# EAGLE schematic zx81 SD_12 (smd) (EAGLE 9.6.2)

## Sheet 1 of 2
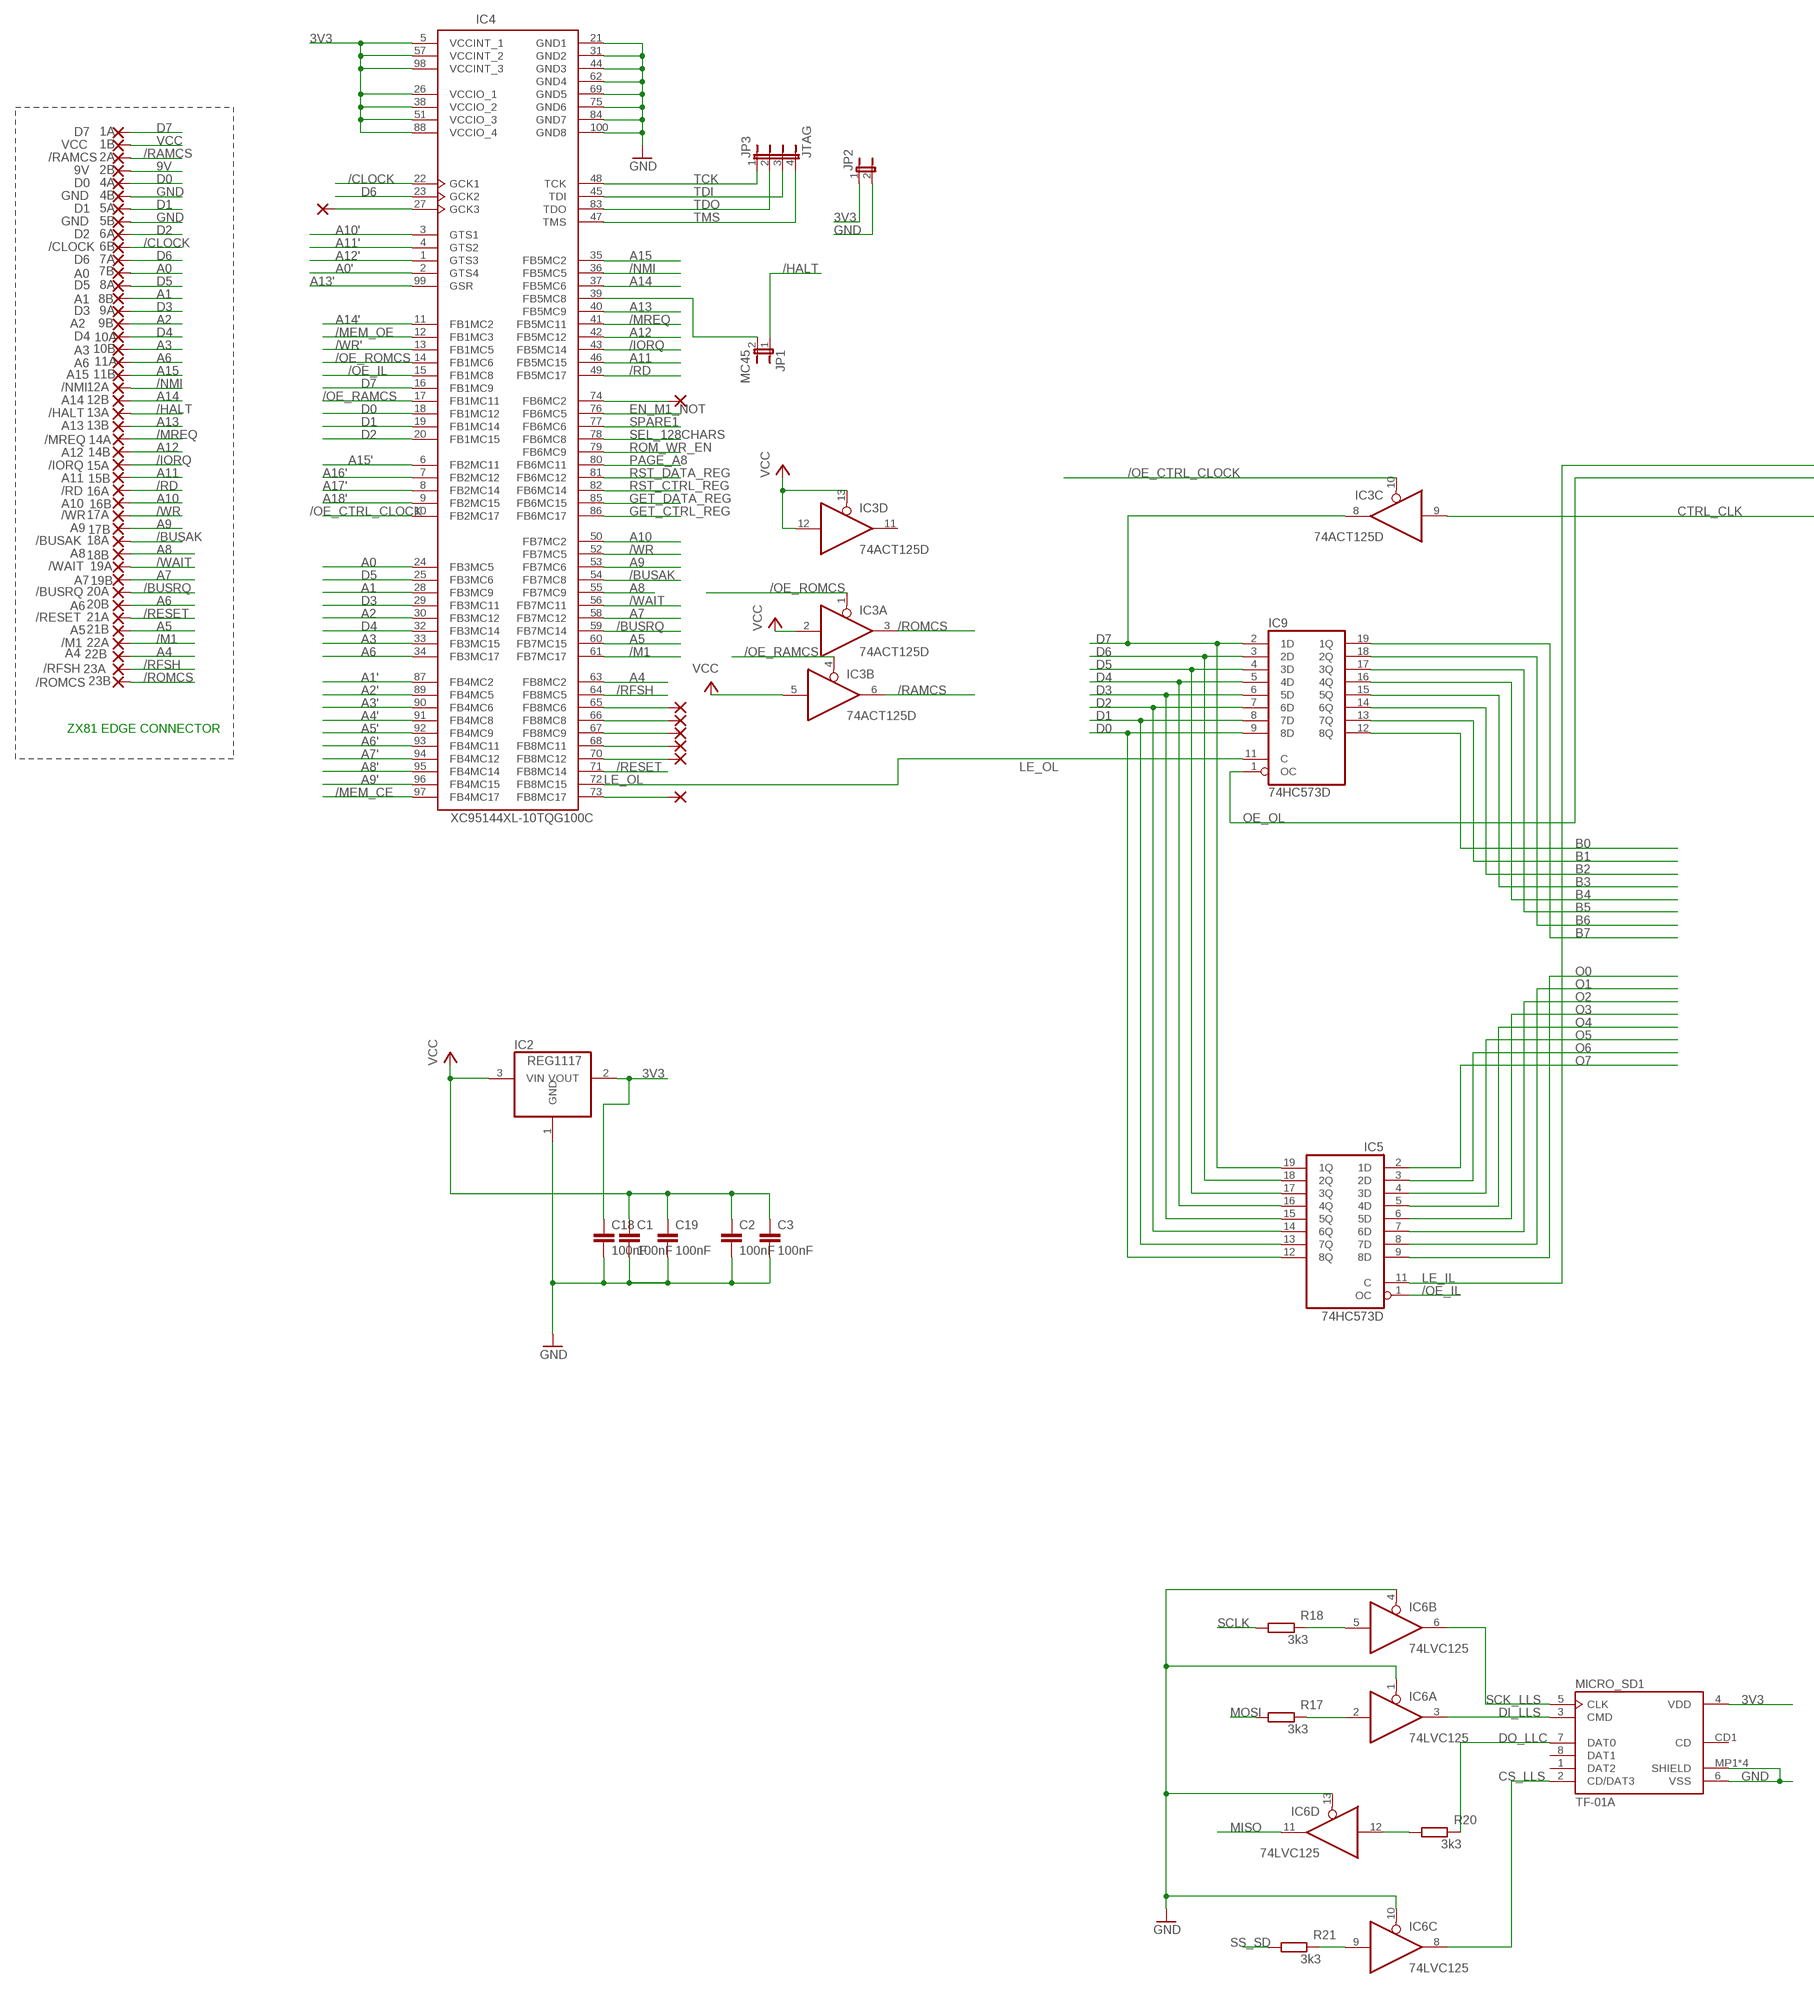
[diagram p0: schematic, sheet 1, part 1 of 2]
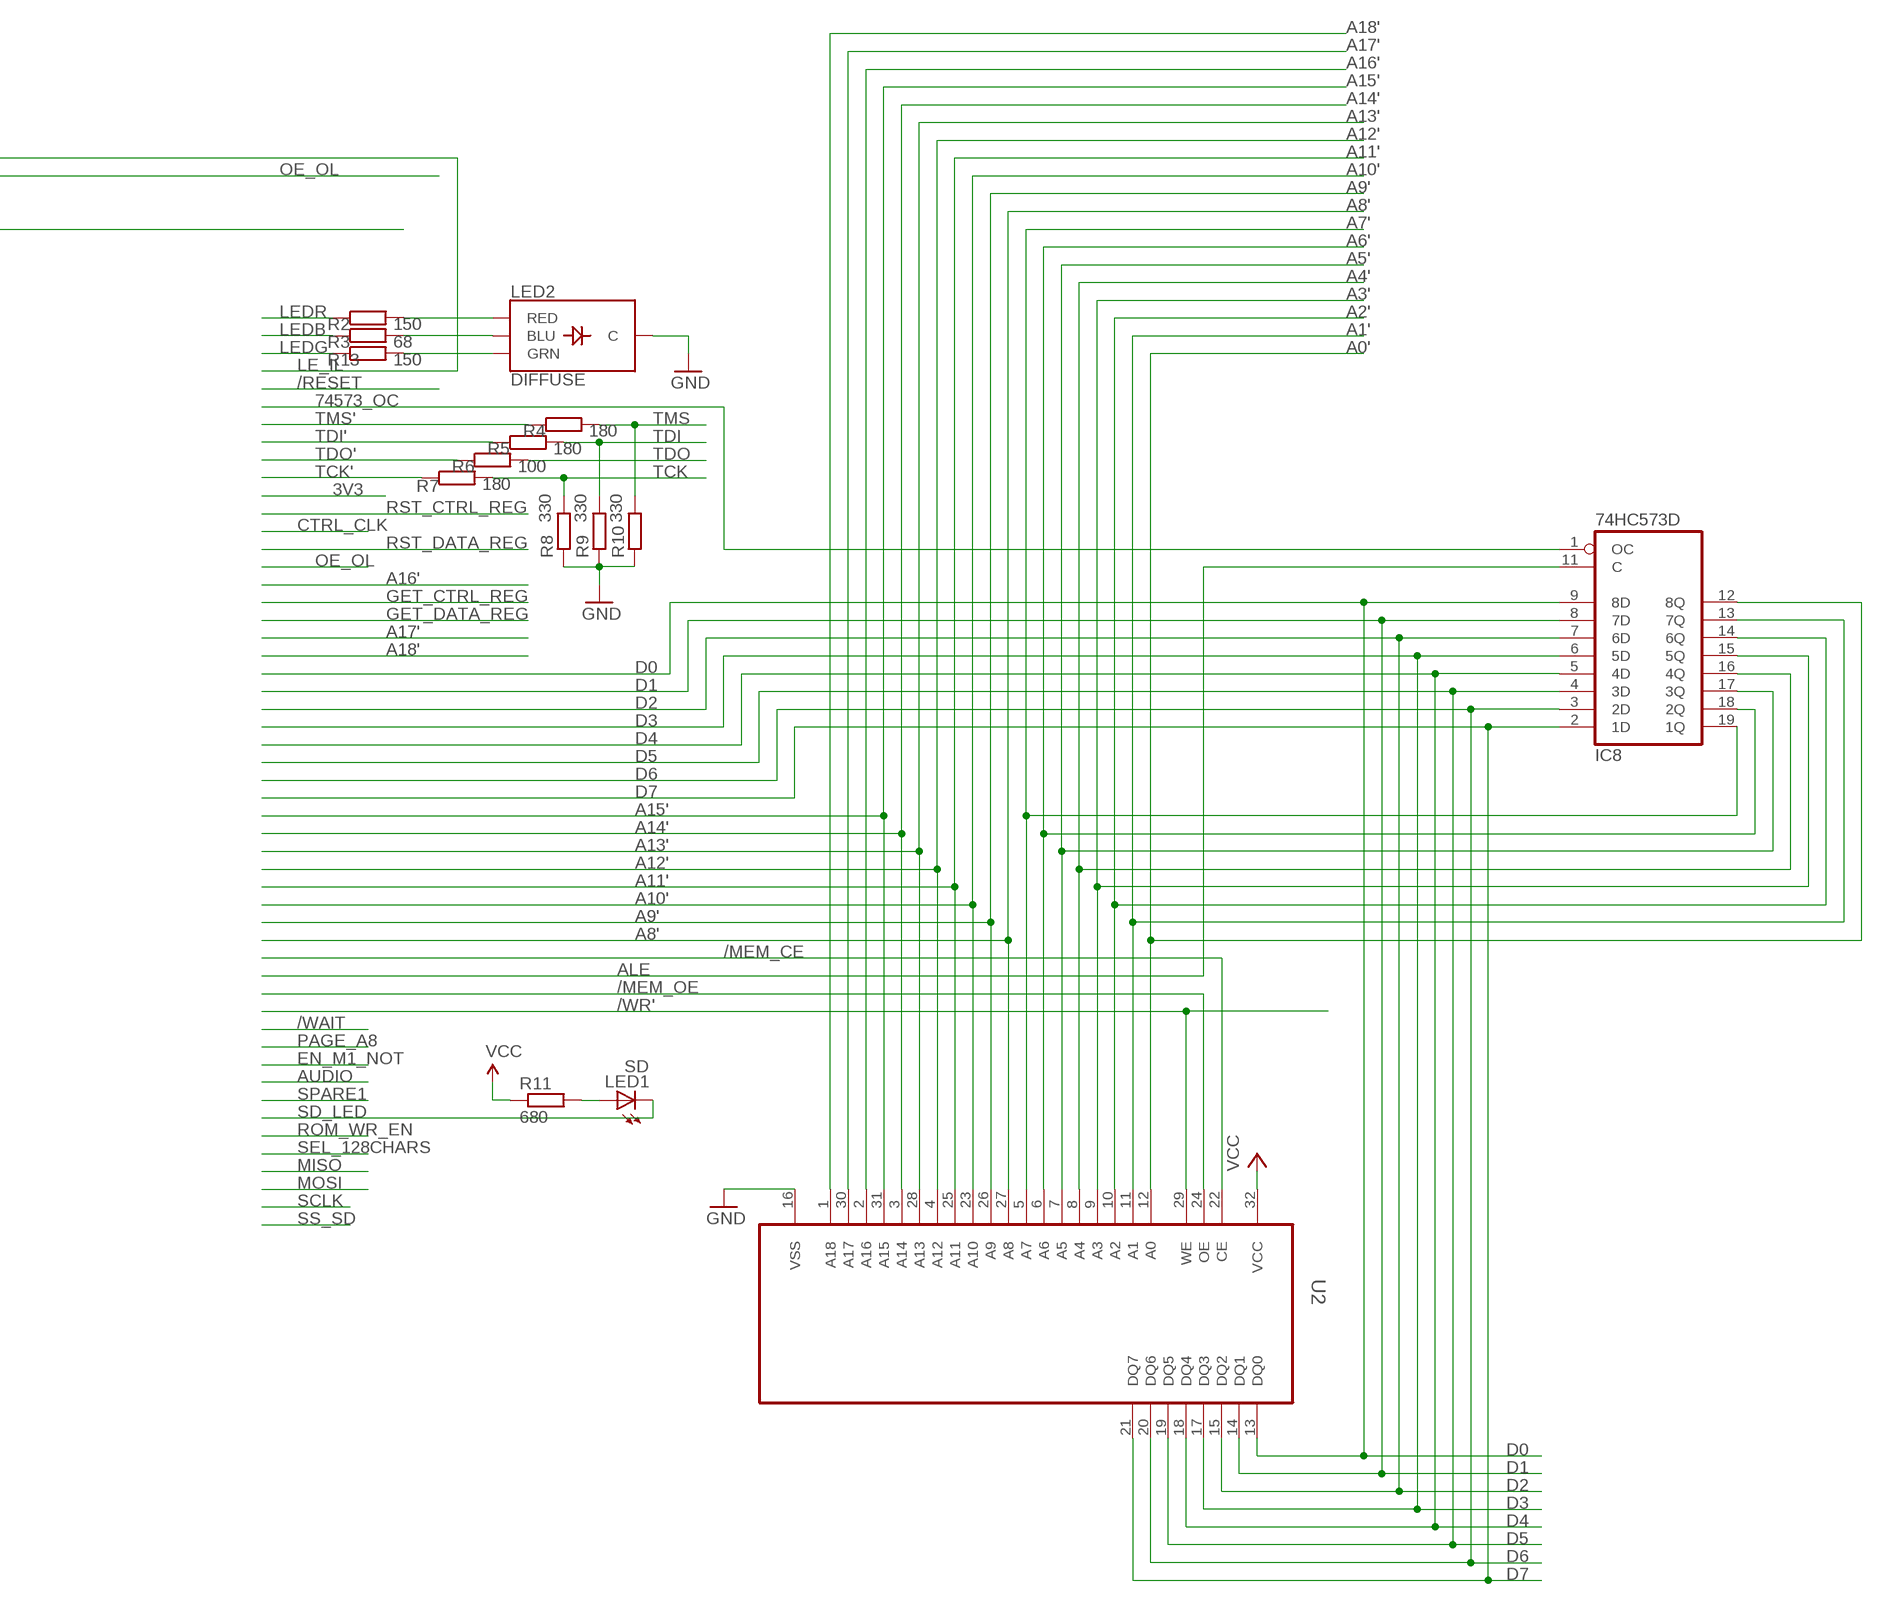
[diagram p1: schematic, sheet 1, part 2 of 2]

### Parts
1A  D7  SMD2EDGEPIN  [EDGEPIN]
1B  VCC  SMD2EDGEPIN  [EDGEPIN]
2A  /RAMCS  SMD2EDGEPIN  [EDGEPIN]
2B  9V  SMD2EDGEPIN  [EDGEPIN]
4A  D0  SMD2EDGEPIN  [EDGEPIN]
4B  GND  SMD2EDGEPIN  [EDGEPIN]
5A  D1  SMD2EDGEPIN  [EDGEPIN]
5B  GND  SMD2EDGEPIN  [EDGEPIN]
6A  D2  SMD2EDGEPIN  [EDGEPIN]
6B  /CLOCK  SMD2EDGEPIN  [EDGEPIN]
7A  D6  SMD2EDGEPIN  [EDGEPIN]
7B  A0  SMD2EDGEPIN  [EDGEPIN]
8A  D5  SMD2EDGEPIN  [EDGEPIN]
8B  A1  SMD2EDGEPIN  [EDGEPIN]
9A  D3  SMD2EDGEPIN  [EDGEPIN]
9B  A2  SMD2EDGEPIN  [EDGEPIN]
10A  D4  SMD2EDGEPIN  [EDGEPIN]
10B  A3  SMD2EDGEPIN  [EDGEPIN]
11A  A6  SMD2EDGEPIN  [EDGEPIN]
11B  A15  SMD2EDGEPIN  [EDGEPIN]
12A  /NMI  SMD2EDGEPIN  [EDGEPIN]
12B  A14  SMD2EDGEPIN  [EDGEPIN]
13A  /HALT  SMD2EDGEPIN  [EDGEPIN]
13B  A13  SMD2EDGEPIN  [EDGEPIN]
14A  /MREQ  SMD2EDGEPIN  [EDGEPIN]
14B  A12  SMD2EDGEPIN  [EDGEPIN]
15A  /IORQ  SMD2EDGEPIN  [EDGEPIN]
15B  A11  SMD2EDGEPIN  [EDGEPIN]
16A  /RD  SMD2EDGEPIN  [EDGEPIN]
16B  A10  SMD2EDGEPIN  [EDGEPIN]
17A  /WR  SMD2EDGEPIN  [EDGEPIN]
17B  A9  SMD2EDGEPIN  [EDGEPIN]
18A  /BUSAK  SMD2EDGEPIN  [EDGEPIN]
18B  A8  SMD2EDGEPIN  [EDGEPIN]
19A  /WAIT  SMD2EDGEPIN  [EDGEPIN]
19B  A7  SMD2EDGEPIN  [EDGEPIN]
20A  /BUSRQ  SMD2EDGEPIN  [EDGEPIN]
20B  A6  SMD2EDGEPIN  [EDGEPIN]
21A  /RESET  SMD2EDGEPIN  [EDGEPIN]
21B  A5  SMD2EDGEPIN  [EDGEPIN]
22A  /M1  SMD2EDGEPIN  [EDGEPIN]
22B  A4  SMD2EDGEPIN  [EDGEPIN]
23A  /RFSH  SMD2EDGEPIN  [EDGEPIN]
23B  /ROMCS  SMD2EDGEPIN  [EDGEPIN]
C1  100nF  C-EUC0603  [C0603]
C2  100nF  C-EUC0603  [C0603]
C3  100nF  C-EUC0603  [C0603]
C18  100nF  C-EUC0603  [C0603]
C19  100nF  C-EUC0603  [C0603]
IC2  REG1117  [SOT223]
IC3  74ACT125D  [SO14]
IC4  XC95144XL-10TQG100C  [TQFP100]
IC5  74HC573D  [SO20W]
IC6  74LVC125  74LS125D  [SO14]
IC8  74HC573D  [SO20W]
IC9  74HC573D  [SO20W]
JP1  MC45  JP1E  [JP1]
JP2  JP1E  [JP1]
JP3  JTAG  JP4E  [JP4]
LED1  SD  LED5MM  [LED5MM]
LED2  DIFFUSE  LED-RGB-CCDIFFUSE  [LED-RGB-THRU]
MICRO_SD1  TF-01A  [TF-01A]
PAD1  1,6/0,8  [1,6/0,8]
PAD2  1,6/0,8  [1,6/0,8]
PAD3  1,6/0,8  [1,6/0,8]
PAD4  1,6/0,8  [1,6/0,8]
PAD5  1,6/0,8  [1,6/0,8]
PAD6  1,6/0,8  [1,6/0,8]
PAD7  1,6/0,8  [1,6/0,8]
PAD8  1,6/0,8  [1,6/0,8]
R2  150  R-EU_R0603  [R0603]
R3  68  R-EU_R0603  [R0603]
R4  180  R-EU_R0603  [R0603]
R5  180  R-EU_R0603  [R0603]
R6  100  R-EU_R0603  [R0603]
R7  180  R-EU_R0603  [R0603]
R8  330  R-EU_R0603  [R0603]
R9  330  R-EU_R0603  [R0603]
R10  330  R-EU_R0603  [R0603]
R11  680  R-EU_R0603  [R0603]
R13  150  R-EU_R0603  [R0603]
R17  3k3  R-EU_R0603  [R0603]
R18  3k3  R-EU_R0603  [R0603]
R20  3k3  R-EU_R0603  [R0603]
R21  3k3  R-EU_R0603  [R0603]
U2  AS6C4008-55SINSOP5  [SOP32-5]

### Nets
3V3: C18.1 IC2.2(VOUT) IC4.5(VCCINT_1) IC4.26(VCCIO_1) IC4.38(VCCIO_2) IC4.51(VCCIO_3) IC4.57(VCCINT_2) IC4.88(VCCIO_4) IC4.98(VCCINT_3) JP2.1 MICRO_SD1.4(VDD) ; also sheet 2
9V [VCC]: 2B.1(P)
74573_OC: IC8.1(OC) ; also sheet 2
/BUSAK: 18A.1(P) IC4.54(FB7MC8)
/BUSRQ: 20A.1(P) IC4.59(FB7MC14)
/CLOCK: 6B.1(P) IC4.22(GCK1)
/HALT: 13A.1(P) JP1.1
/IORQ: 15A.1(P) IC4.43(FB5MC14)
/M1: 22A.1(P) IC4.61(FB7MC17)
/MEM_CE: IC4.97(FB4MC17) U2.22(CE) ; also sheet 2
/MEM_OE: IC4.12(FB1MC3) U2.24(OE) ; also sheet 2
/MREQ: 14A.1(P) IC4.41(FB5MC11)
/NMI: 12A.1(P) IC4.36(FB5MC5)
/OE_CTRL_CLOCK: IC3.10(C:OE) IC4.10(FB2MC17)
/OE_IL: IC4.15(FB1MC8) IC5.1(OC)
/OE_RAMCS: IC3.4(B:OE) IC4.17(FB1MC11)
/OE_ROMCS: IC3.1(A:OE) IC4.14(FB1MC6)
/RAMCS: 2A.1(P) IC3.6(B:O)
/RD: 16A.1(P) IC4.49(FB5MC17)
/RESET: 21A.1(P) IC4.71(FB8MC14) ; also sheet 2
/RFSH: 23A.1(P) IC4.64(FB8MC5)
/ROMCS: 23B.1(P) IC3.3(A:O)
/WAIT: 19A.1(P) IC4.56(FB7MC11) ; also sheet 2
/WR: 17A.1(P) IC4.52(FB7MC5)
/WR': IC4.13(FB1MC5) U2.29(WE) ; also sheet 2
A0: 7B.1(P) IC4.24(FB3MC5)
A0': IC4.2(GTS4) IC8.12(8Q) U2.12(A0)
A1: 8B.1(P) IC4.28(FB3MC9)
A1': IC4.87(FB4MC2) IC8.13(7Q) U2.11(A1)
A2: 9B.1(P) IC4.30(FB3MC12)
A2': IC4.89(FB4MC5) IC8.14(6Q) U2.10(A2)
A3: 10B.1(P) IC4.33(FB3MC15)
A3': IC4.90(FB4MC6) IC8.15(5Q) U2.9(A3)
A4: 22B.1(P) IC4.63(FB8MC2)
A4': IC4.91(FB4MC8) IC8.16(4Q) U2.8(A4)
A5: 21B.1(P) IC4.60(FB7MC15)
A5': IC4.92(FB4MC9) IC8.17(3Q) U2.7(A5)
A6: 11A.1(P) 20B.1(P) IC4.34(FB3MC17)
A6': IC4.93(FB4MC11) IC8.18(2Q) U2.6(A6)
A7: 19B.1(P) IC4.58(FB7MC12)
A7': IC4.94(FB4MC12) IC8.19(1Q) U2.5(A7)
A8: 18B.1(P) IC4.55(FB7MC9)
A8': IC4.95(FB4MC14) U2.27(A8) ; also sheet 2
A9: 17B.1(P) IC4.53(FB7MC6)
A9': IC4.96(FB4MC15) U2.26(A9) ; also sheet 2
A10: 16B.1(P) IC4.50(FB7MC2)
A10': IC4.3(GTS1) U2.23(A10) ; also sheet 2
A11: 15B.1(P) IC4.46(FB5MC15)
A11': IC4.4(GTS2) U2.25(A11) ; also sheet 2
A12: 14B.1(P) IC4.42(FB5MC12)
A12': IC4.1(GTS3) U2.4(A12) ; also sheet 2
A13: 13B.1(P) IC4.40(FB5MC9)
A13': IC4.99(GSR) U2.28(A13) ; also sheet 2
A14: 12B.1(P) IC4.37(FB5MC6)
A14': IC4.11(FB1MC2) U2.3(A14) ; also sheet 2
A15: 11B.1(P) IC4.35(FB5MC2)
A15': IC4.6(FB2MC11) U2.31(A15) ; also sheet 2
A16': IC4.7(FB2MC12) U2.2(A16) ; also sheet 2
A17': IC4.8(FB2MC14) U2.30(A17) ; also sheet 2
A18': IC4.9(FB2MC15) U2.1(A18) ; also sheet 2
ALE: IC8.11(C) ; also sheet 2
B0: IC9.19(1Q) ; also sheet 2
B1: IC9.18(2Q) ; also sheet 2
B2: IC9.17(3Q) ; also sheet 2
B3: IC9.16(4Q) ; also sheet 2
B4: IC9.15(5Q) ; also sheet 2
B5: IC9.14(6Q) ; also sheet 2
B6: IC9.13(7Q) ; also sheet 2
B7: IC9.12(8Q) ; also sheet 2
CS_LLS: IC6.8(C:O) MICRO_SD1.2(CD/DAT3)
CTRL_CLK: IC3.9(C:I) ; also sheet 2
D0: 4A.1(P) IC4.18(FB1MC12) IC5.12(8Q) IC8.9(8D) IC9.9(8D) U2.13(DQ0) ; also sheet 2
D1: 5A.1(P) IC4.19(FB1MC14) IC5.13(7Q) IC8.8(7D) IC9.8(7D) U2.14(DQ1) ; also sheet 2
D2: 6A.1(P) IC4.20(FB1MC15) IC5.14(6Q) IC8.7(6D) IC9.7(6D) U2.15(DQ2) ; also sheet 2
D3: 9A.1(P) IC4.29(FB3MC11) IC5.15(5Q) IC8.6(5D) IC9.6(5D) U2.17(DQ3) ; also sheet 2
D4: 10A.1(P) IC4.32(FB3MC14) IC5.16(4Q) IC8.5(4D) IC9.5(4D) U2.18(DQ4) ; also sheet 2
D5: 8A.1(P) IC4.25(FB3MC6) IC5.17(3Q) IC8.4(3D) IC9.4(3D) U2.19(DQ5) ; also sheet 2
D6: 7A.1(P) IC4.23(GCK2) IC5.18(2Q) IC8.3(2D) IC9.3(2D) U2.20(DQ6) ; also sheet 2
D7: 1A.1(P) IC3.8(C:O) IC4.16(FB1MC9) IC5.19(1Q) IC8.2(1D) IC9.2(1D) U2.21(DQ7) ; also sheet 2
DI_LLS: IC6.3(A:O) MICRO_SD1.3(CMD)
DO_LLC: IC6.12(D:I) R20.1
EN_M1_NOT: IC4.76(FB6MC5) ; also sheet 2
GET_CTRL_REG: IC4.86(FB6MC17) ; also sheet 2
GET_DATA_REG: IC4.85(FB6MC15) ; also sheet 2
GND [VCC]: 4B.1(P) 5B.1(P) C1.2 C2.2 C3.2 C18.2 C19.2 IC2.1(GND) IC4.21(GND1) IC4.31(GND2) IC4.44(GND3) IC4.62(GND4) IC4.69(GND5) IC4.75(GND6) IC4.84(GND7) IC4.100(GND8) IC6.1(A:OE) IC6.4(B:OE) IC6.10(C:OE) IC6.13(D:OE) JP2.2 LED2.2(C) MICRO_SD1.6(VSS) MICRO_SD1.MP1(SHIELD) MICRO_SD1.MP2(SHIELD) MICRO_SD1.MP3(SHIELD) MICRO_SD1.MP4(SHIELD) R8.1 R9.1 R10.1 U2.16(VSS) ; also sheet 2
LE_IL: IC5.11(C) ; also sheet 2
LE_OL: IC4.72(FB8MC15) IC9.11(C)
LEDB: R3.1 ; also sheet 2
LEDG: R13.1 ; also sheet 2
LEDR: R2.1 ; also sheet 2
MISO: IC6.11(D:O) ; also sheet 2
MOSI: R17.1 ; also sheet 2
N$1: IC6.2(A:I) R17.2
N$2: IC4.74(FB6MC2) PAD8.1(P)
N$9: IC6.5(B:I) R18.2
N$11: IC4.65(FB8MC6) PAD2.1(P)
N$13: MICRO_SD1.7(DAT0) R20.2
N$14: IC6.9(C:I) R21.2
N$15: LED1.A R11.2
N$16: IC4.66(FB8MC8) PAD3.1(P)
N$19: IC4.67(FB8MC9) PAD4.1(P)
N$22: IC4.68(FB8MC11) PAD5.1(P)
N$23: IC4.73(FB8MC17) PAD6.1(P)
N$24: IC4.27(GCK3) PAD1.1(P)
N$25: IC4.70(FB8MC12) PAD7.1(P)
N$26: LED2.1(RED) R2.2
N$27: LED2.4(BLU) R3.2
N$28: LED2.3(GRN) R13.2
N$33: IC4.39(FB5MC8) JP1.2
O0: IC5.2(1D) ; also sheet 2
O1: IC5.3(2D) ; also sheet 2
O2: IC5.4(3D) ; also sheet 2
O3: IC5.5(4D) ; also sheet 2
O4: IC5.6(5D) ; also sheet 2
O5: IC5.7(6D) ; also sheet 2
O6: IC5.8(7D) ; also sheet 2
O7: IC5.9(8D) ; also sheet 2
OE_OL: IC9.1(OC) ; also sheet 2
PAGE_A8: IC4.80(FB6MC11) ; also sheet 2
ROM_WR_EN: IC4.79(FB6MC9) ; also sheet 2
RST_CTRL_REG: IC4.82(FB6MC14) ; also sheet 2
RST_DATA_REG: IC4.81(FB6MC12) ; also sheet 2
SCK_LLS: IC6.6(B:O) MICRO_SD1.5(CLK)
SCLK: R18.1 ; also sheet 2
SD_LED: LED1.K(C) ; also sheet 2
SEL_128CHARS: IC4.78(FB6MC8) ; also sheet 2
SPARE1: IC4.77(FB6MC6) ; also sheet 2
SS_SD: R21.1 ; also sheet 2
TCK: IC4.48(TCK) JP3.1 R7.2 R8.2
TCK': R7.1 ; also sheet 2
TDI: IC4.45(TDI) JP3.3 R5.2 R9.2
TDI': R5.1 ; also sheet 2
TDO: IC4.83(TDO) JP3.2 R6.2
TDO': R6.1 ; also sheet 2
TMS: IC4.47(TMS) JP3.4 R4.2 R10.2
TMS': R4.1 ; also sheet 2
VCC [VCC]: 1B.1(P) C1.1 C2.1 C3.1 C19.1 IC2.3(VIN) IC3.2(A:I) IC3.5(B:I) IC3.12(D:I) IC3.13(D:OE) R11.1 U2.32(VCC) ; also sheet 2
Unconnected: IC3.11(D:O) MICRO_SD1.1(DAT2) MICRO_SD1.8(DAT1) MICRO_SD1.CD1(CD)

### Notes on the sheet
- ZX81 EDGE CONNECTOR

## Sheet 2 of 2
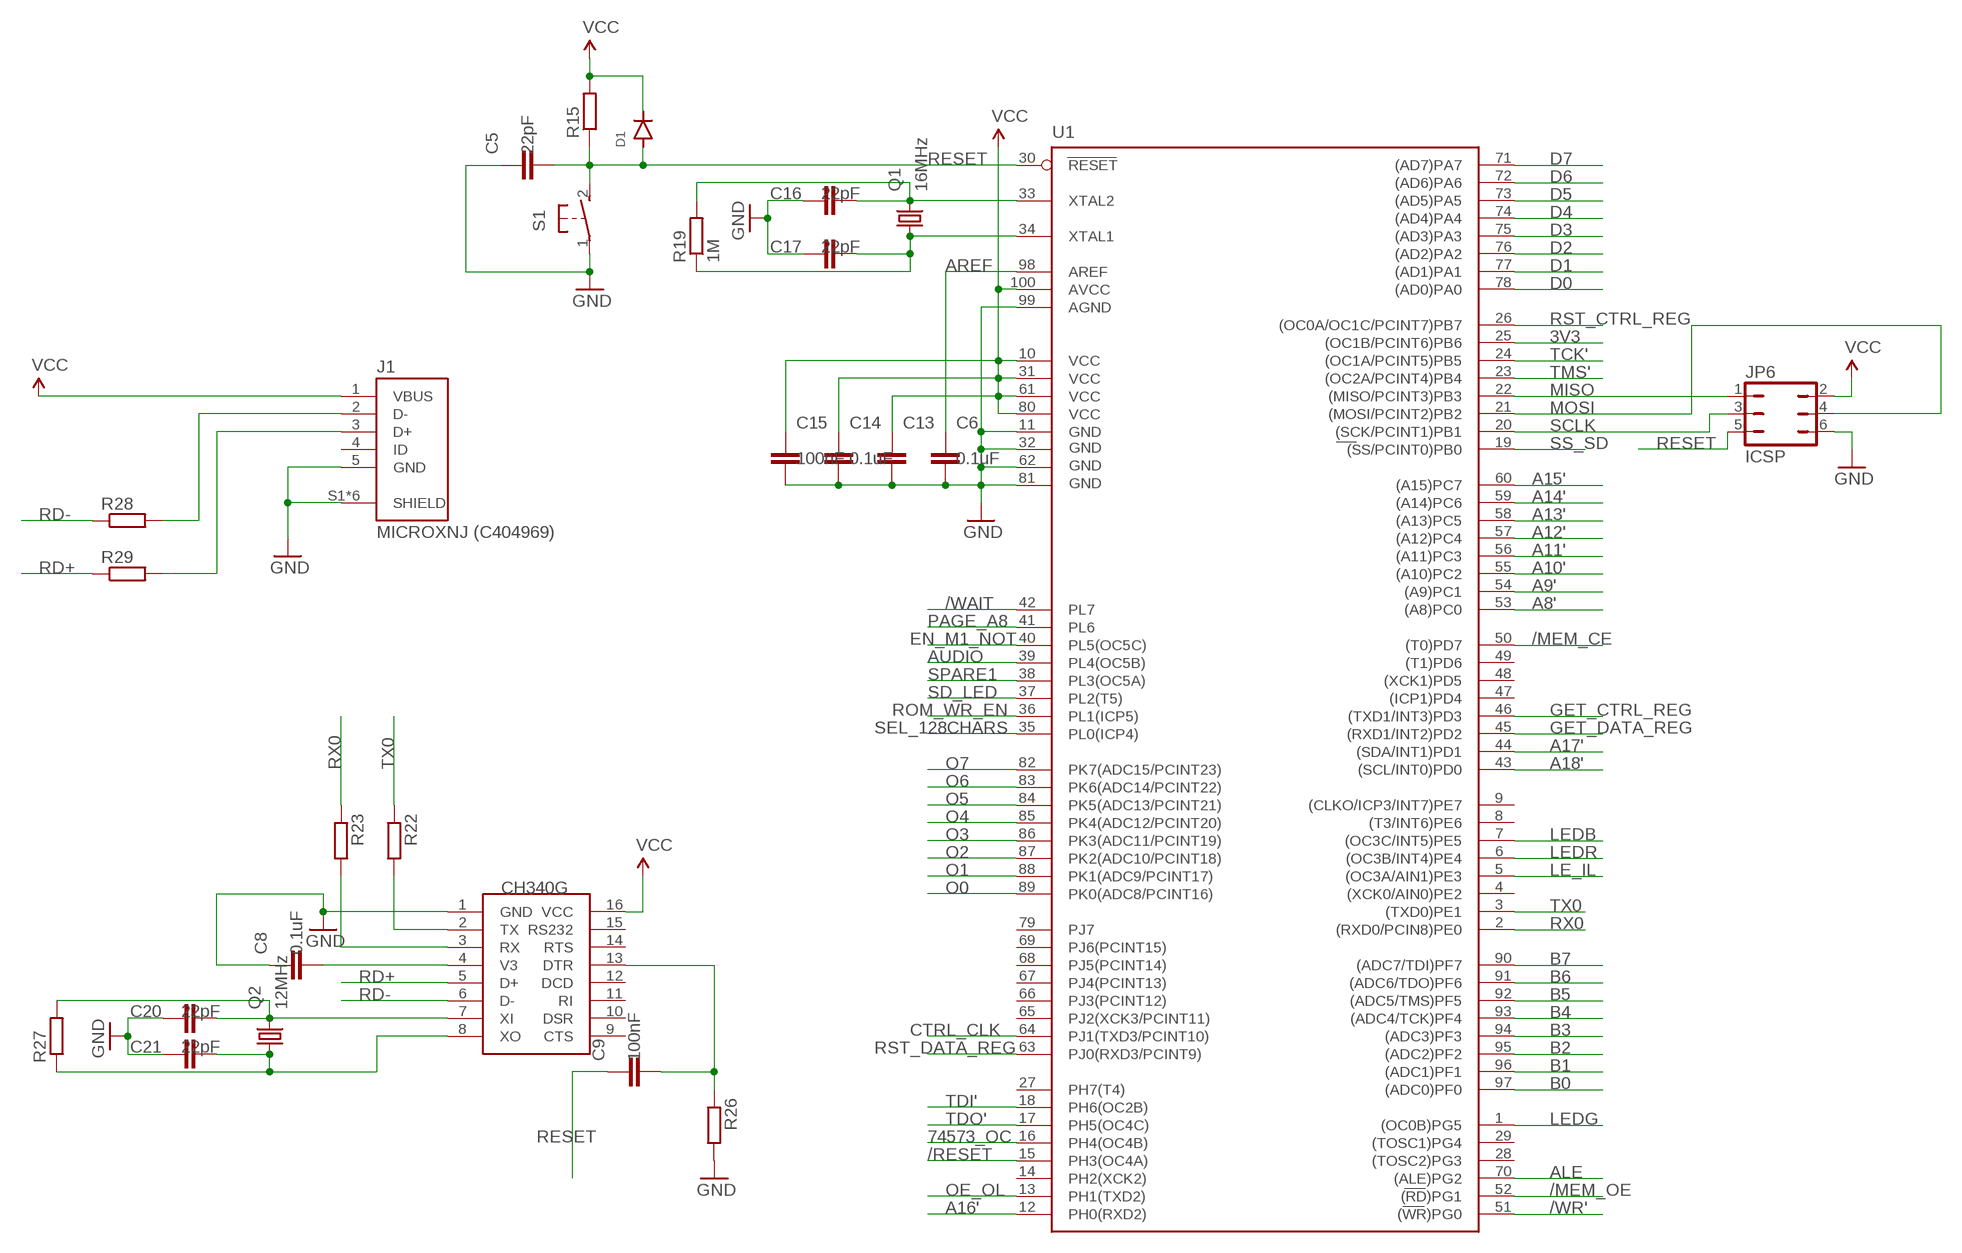
[diagram p2: schematic, sheet 2]

### Parts
C5  22pF  C-EUC0603  [C0603]
C6  0.1uF  C-EUC0603  [C0603]
C8  0.1uF  C-EUC0603  [C0603]
C9  100nF  C-EUC0603  [C0603]
C13  0.1uF  C-EUC0603  [C0603]
C14  0.1uF  C-EUC0603  [C0603]
C15  100nF  C-EUC0603  [C0603]
C16  22pF  C-EUC0603  [C0603]
C17  22pF  C-EUC0603  [C0603]
C20  22pF  C-EUC0603  [C0603]
C21  22pF  C-EUC0603  [C0603]
D1  DIODE-SOD123  [SOD123]
IC7  CH340G  [SOIC16]
J1  MICROXNJ (C404969)  MICROXNJ  [SHOUHAN_MICROXNJ]
JP6  ICSP  JP3Q  [JP3Q]
Q1  16MHz  KX-7  [3.2X2.5_KX-7]
Q2  12MHz  KX-7  [3.2X2.5_KX-7]
R15  R-EU_R0603  [R0603]
R19  1M  R-EU_R0603  [R0603]
R22  1K  R-EU_R0603  [R0603]
R23  1K  R-EU_R0603  [R0603]
R26  1K  R-EU_R0603  [R0603]
R27  1M  R-EU_R0603  [R0603]
R28  22R  R-EU_R0603  [R0603]
R29  22R  R-EU_R0603  [R0603]
S1  31-XX  [B3F-31XX]
U1  ATMEGA2560AU  [TQFP100]

### Nets
3V3: U1.25((OC1B/PCINT6)PB6) ; also sheet 1
74573_OC: U1.16(PH4(OC4B)) ; also sheet 1
/MEM_CE: U1.50((T0)PD7) ; also sheet 1
/MEM_OE: U1.52((RD)PG1) ; also sheet 1
/RESET: U1.15(PH3(OC4A)) ; also sheet 1
/WAIT: U1.42(PL7) ; also sheet 1
/WR': U1.51((WR)PG0) ; also sheet 1
A8': U1.53((A8)PC0) ; also sheet 1
A9': U1.54((A9)PC1) ; also sheet 1
A10': U1.55((A10)PC2) ; also sheet 1
A11': U1.56((A11)PC3) ; also sheet 1
A12': U1.57((A12)PC4) ; also sheet 1
A13': U1.58((A13)PC5) ; also sheet 1
A14': U1.59((A14)PC6) ; also sheet 1
A15': U1.60((A15)PC7) ; also sheet 1
A16': U1.12(PH0(RXD2)) ; also sheet 1
A17': U1.44((SDA/INT1)PD1) ; also sheet 1
A18': U1.43((SCL/INT0)PD0) ; also sheet 1
ALE: U1.70((ALE)PG2) ; also sheet 1
AREF: C6.1 U1.98(AREF)
AUDIO: U1.39(PL4(OC5B)) ; also sheet 1
B0: U1.97((ADC0)PF0) ; also sheet 1
B1: U1.96((ADC1)PF1) ; also sheet 1
B2: U1.95((ADC2)PF2) ; also sheet 1
B3: U1.94((ADC3)PF3) ; also sheet 1
B4: U1.93((ADC4/TCK)PF4) ; also sheet 1
B5: U1.92((ADC5/TMS)PF5) ; also sheet 1
B6: U1.91((ADC6/TDO)PF6) ; also sheet 1
B7: U1.90((ADC7/TDI)PF7) ; also sheet 1
CTRL_CLK: U1.64(PJ1(TXD3/PCINT10)) ; also sheet 1
D0: U1.78((AD0)PA0) ; also sheet 1
D1: U1.77((AD1)PA1) ; also sheet 1
D2: U1.76((AD2)PA2) ; also sheet 1
D3: U1.75((AD3)PA3) ; also sheet 1
D4: U1.74((AD4)PA4) ; also sheet 1
D5: U1.73((AD5)PA5) ; also sheet 1
D6: U1.72((AD6)PA6) ; also sheet 1
D7: U1.71((AD7)PA7) ; also sheet 1
EN_M1_NOT: U1.40(PL5(OC5C)) ; also sheet 1
GET_CTRL_REG: U1.46((TXD1/INT3)PD3) ; also sheet 1
GET_DATA_REG: U1.45((RXD1/INT2)PD2) ; also sheet 1
GND [VCC]: C5.1 C6.2 C8.1 C13.2 C14.2 C15.2 C16.1 C17.1 C20.1 C21.1 IC7.1(GND) J1.5(GND) J1.S1(SHIELD) J1.S2(SHIELD) J1.S3(SHIELD) J1.S4(SHIELD) J1.S5(SHIELD) J1.S6(SHIELD) JP6.6 R26.2 S1.1(P) U1.11(GND) U1.32(GND1) U1.62(GND2) U1.81(GND3) U1.99(AGND) ; also sheet 1
LE_IL: U1.5((OC3A/AIN1)PE3) ; also sheet 1
LEDB: U1.7((OC3C/INT5)PE5) ; also sheet 1
LEDG: U1.1((OC0B)PG5) ; also sheet 1
LEDR: U1.6((OC3B/INT4)PE4) ; also sheet 1
MISO: JP6.1 U1.22((MISO/PCINT3)PB3) ; also sheet 1
MOSI: JP6.4 U1.21((MOSI/PCINT2)PB2) ; also sheet 1
N$4: IC7.2(TX) R22.2
N$12: IC7.3(RX) R23.2
N$30: C8.2 IC7.4(V3)
N$31: C20.2 IC7.7(XI) Q2.3 R27.2
N$32: C21.2 IC7.8(XO) Q2.1 R27.1
N$36: C16.2 Q1.3 R19.2 U1.33(XTAL2)
N$37: C17.2 Q1.1 R19.1 U1.34(XTAL1)
N$39: C9.2 IC7.13(DTR) R26.1
N$41: J1.2(D-) R28.2
N$42: J1.3(D+) R29.2
O0: U1.89(PK0(ADC8/PCINT16)) ; also sheet 1
O1: U1.88(PK1(ADC9/PCINT17)) ; also sheet 1
O2: U1.87(PK2(ADC10/PCINT18)) ; also sheet 1
O3: U1.86(PK3(ADC11/PCINT19)) ; also sheet 1
O4: U1.85(PK4(ADC12/PCINT20)) ; also sheet 1
O5: U1.84(PK5(ADC13/PCINT21)) ; also sheet 1
O6: U1.83(PK6(ADC14/PCINT22)) ; also sheet 1
O7: U1.82(PK7(ADC15/PCINT23)) ; also sheet 1
OE_OL: U1.13(PH1(TXD2)) ; also sheet 1
PAGE_A8: U1.41(PL6) ; also sheet 1
RD+: IC7.5(D+) R29.1
RD-: IC7.6(D-) R28.1
RESET: C5.2 C9.1 D1.A JP6.5 R15.1 S1.2(S) U1.30(RESET)
ROM_WR_EN: U1.36(PL1(ICP5)) ; also sheet 1
RST_CTRL_REG: U1.26((OC0A/OC1C/PCINT7)PB7) ; also sheet 1
RST_DATA_REG: U1.63(PJ0(RXD3/PCINT9)) ; also sheet 1
RX0: R23.1 U1.2((RXD0/PCIN8)PE0)
SCLK: JP6.3 U1.20((SCK/PCINT1)PB1) ; also sheet 1
SD_LED: U1.37(PL2(T5)) ; also sheet 1
SEL_128CHARS: U1.35(PL0(ICP4)) ; also sheet 1
SPARE1: U1.38(PL3(OC5A)) ; also sheet 1
SS_SD: U1.19((SS/PCINT0)PB0) ; also sheet 1
TCK': U1.24((OC1A/PCINT5)PB5) ; also sheet 1
TDI': U1.18(PH6(OC2B)) ; also sheet 1
TDO': U1.17(PH5(OC4C)) ; also sheet 1
TMS': U1.23((OC2A/PCINT4)PB4) ; also sheet 1
TX0: R22.1 U1.3((TXD0)PE1)
VCC [VCC]: C13.1 C14.1 C15.1 D1.C IC7.16(VCC) J1.1(VBUS) JP6.2 R15.2 U1.10(VCC) U1.31(VCC1) U1.61(VCC2) U1.80(VCC3) U1.100(AVCC) ; also sheet 1
Unconnected: IC7.9(CTS) IC7.10(DSR) IC7.11(RI) IC7.12(DCD) IC7.14(RTS) IC7.15(RS232) J1.4(ID) U1.4((XCK0/AIN0)PE2) U1.8((T3/INT6)PE6) U1.9((CLKO/ICP3/INT7)PE7) U1.14(PH2(XCK2)) U1.27(PH7(T4)) U1.28((TOSC2)PG3) U1.29((TOSC1)PG4) U1.47((ICP1)PD4) U1.48((XCK1)PD5) U1.49((T1)PD6) U1.65(PJ2(XCK3/PCINT11)) U1.66(PJ3(PCINT12)) U1.67(PJ4(PCINT13)) U1.68(PJ5(PCINT14)) U1.69(PJ6(PCINT15)) U1.79(PJ7)

## Power pins joined to a net without a drawn wire
GND: IC3.7(P:GND) IC5.10(GND) IC6.7(P:GND) IC8.10(GND) IC9.10(GND)
VCC: IC3.14(P:VCC) IC5.20(VCC) IC6.14(P:VCC) IC8.20(VCC) IC9.20(VCC)

## Library data of the parts
1A 1B 2A 2B 4A 4B 5A 5B 6A 6B 7A 7B 8A 8B 9A 9B 10A 10B 11A 11B 12A 12B 13A 13B 14A 14B 15A 15B 16A 16B 17A 17B 18A 18B 19A 19B 20A 20B 21A 21B 22A 22B 23A 23B = wirepad:SMD2: SMD PAD
C1-C3 C5 C6 C8 C9 C13-C21 = rcl:C-EU: CAPACITOR, European symbol; SPICEPREFIX: C
D1 = diode:DIODE-: DIODE
IC2 = burr-brown:REG1117: 800mA and 1A Low Dropout (LDO) Positive Regulator 1.8V, 2.5V, 2.85V, 3.3V, 5V, and Adj; MPN: REG1117; OC_FARNELL: 1097566; OC_NEWARK: 14P6981
IC3 IC6 = 74xx-eu:74*125: Quad bus BUFFER, 3-state
IC4 = XC95144XL-10TQG100C:XC95144XL-10TQG100C: Xilinx 9500XL series CPLD, 144 Macrocells, -10 speed grade. 100pin. Check availability <https://pricing.snapeda.com/parts/XC95144XL-10TQG100C/Xilinx%20Inc./view-part?ref=eda>; AVAILABILITY: In Stock; DESCRIPTION: IC CPLD 144MC 10NS 100TQFP; MF: Xilinx Inc.; MP: XC95144XL-10TQG100C; PACKAGE: TQFP-100 Xilinx; PRICE: None; PURCHASE-URL: https://pricing.snapeda.com/search/part/XC95144XL-10TQG100C/?ref=eda
IC5 IC8 IC9 = 74xx-eu:74*573: 8-bit D latch BUS DRIVER
IC7 = ch340g:CH340G
J1 = MICROXNJ:MICROXNJ: Check availability <https://pricing.snapeda.com/parts/MICROXNJ/Shouhan/view-part?ref=eda>; AVAILABILITY: Not in stock; CHECK_PRICES: https://www.snapeda.com/parts/MICROXNJ/Shouhan/view-part/?ref=eda; DESCRIPTION: Sensor Cables / Actuator Cables; MF: Shouhan; MP: MICROXNJ; PACKAGE: Package; PRICE: None; SNAPEDA_LINK: https://www.snapeda.com/parts/MICROXNJ/Shouhan/view-part/?ref=snap
JP1 JP2 = jumper:JP1E: JUMPER
JP3 = jumper:JP4E: JUMPER
JP6 = jumper:JP3Q: JUMPER
LED1 = adafruit:LED: LED OSRAM: - CHIPLED LG R971, LG N971, LY N971, LG Q971, LY Q971, LO R971, LY R971 LH N974, LH R974 LS Q976, LO Q976, LY Q976 LO Q996 - Hyper CHIPLED LW Q18S LB Q993, LB Q99A, LB R99A - SideLED LS A670, LO A670, LY A670, LG A670, LP A670 LB A673, LV A673, LT A673, LW A673 LH A674 LY A675 LS A676, LA A676, LO A676, LY A676, LW A676 LS A679, LY A679, LG A679 - Hyper Micro SIDELED® LS Y876, LA Y876, LO Y876, LY Y876 LT Y87S - SmartLED LW L88C, LW L88S LB L89C, LB L89S, LG L890 LS L89K, LO L89K, LY L89K LS L896, LA L896, LO L896, LY L896 - TOPLED LS T670, LO T670, LY T670, LG T670, LP T670 LSG T670, LSP T670, LSY T670, LOP T670, LYG T670 LG T671, LOG T671, LSG T671 LB T673, LV T673, LT T673, LW T673 LH T674 LS T676, LA T676, LO T676, LY T676, LB T676, LH T676, LSB T676, LW T676 LB T67C, LV T67C, LT T67C, LS T67K, LO T67K, LY T67K, LW E67C LS E67B, LA E67B, LO E67B, LY E67B, LB E67C, LV E67C, LT E67C LW T67C LS T679, LY T679, LG T679 LS T770, LO T770, LY T770, LG T770, LP T770 LB T773, LV T773, LT T773, LW T773 LH T774 LS E675, LA E675, LY E675, LS T675 LS T776, LA T776, LO T776, LY T776, LB T776 LHGB T686 LT T68C, LB T68C - Hyper Mini TOPLED® LB M676 - Mini TOPLED Santana® LG M470 LS M47K, LO M47K, LY M47K Source: http://www.osram.convergy.de/
LED2 = SparkFun-LEDV1:LED-RGB-CC: LED-RGB Common Cathode Packages: LED RGB-THRU LED_PIRANHA_5MM SparkFun Products: RGB Diffused Common Cathode- Diffuse <[https://www.sparkfun.com/products/9264]> RGB Diffused Common Cathode - Clear <[https://www.sparkfun.com/products/105]> LED-RGB 5mm Square (Piranha) <[https://www.sparkfun.com/products/11679]>; PROD_ID: DIO-09434
MICRO_SD1 = TF-01A:TF-01A: Check availability <https://pricing.snapeda.com/parts/TF-01A/HRO%20Electronics%20Co.%2C%20Ltd./view-part?ref=eda>; AVAILABILITY: Not in stock; CHECK_PRICES: https://www.snapeda.com/parts/TF-01A/HRO+Electronics+Co.%252C+Ltd./view-part/?ref=eda; DESCRIPTION: Standard Card Edge Connectors; MF: HRO Electronics Co., Ltd.; MP: TF-01A; PACKAGE: Package; PRICE: None; SNAPEDA_LINK: https://www.snapeda.com/parts/TF-01A/HRO+Electronics+Co.%252C+Ltd./view-part/?ref=snap
PAD1-PAD8 = wirepad:1,6/0,8: THROUGH-HOLE PAD
Q1 Q2 = crystal-geyer_V1_0:KX: Quartz Crystals (MHz) SMD: KX - Serie Model Size l/w/h [mm] Frequency Range Frequency Stability Temp. Range [°C] Load Capacitance AECQ 200 availabel Datasheet KX-4 KX-5 KX-6 KX-7 KX-9A KX-9B KX-12A KX-12B KX-13 KX-20 KX-K KX-KS 1.6/1.2/0.3 2.0/1.6/0.45 2.5/2.0/0.55 3.2/2.5/0.8 5.0/3.2/1.0 5.0/3.2/1.1 6.0/3.5/1.1 6.0/3.5/1.0 7.0/5.0 /1.3 11.6/5.5/1.6 12.3/4.5/4.2 12.3/4.5/3.2 24.0 ~ 80.0 MHz 16.0 ~ 80.0 MHz 12.0 ~ 80.0 MHz 8.0 ~ 60.0 MHz 7,68 ~ 300,0 MHz 8,0 ~ 50,0 MHz 8,0 ~ 150,0 MHz 8,0 ~ 50,0 MHz 6,0 ~ 160,0 MHz 3,579 ~ 25,0 MHz 3,579 ~ 70,0 MHz 3,579 ~ 70,0 MHz ±10 … ±50ppm ±10 … ±50ppm ±10 … ±50ppm ±10 … ±50ppm ±10 … ±50ppm ±10 … ±50ppm ±10 … ±50ppm ±10 … ±50ppm ±10 … ±50ppm ±50ppm ±10 … ±50ppm ±10 … ±50ppm (*) -40°C …+85°C (*) -40°C …+125°C (*) -40°C …+125°C (*) -40°C …+125°C (*) -40°C …+105°C (*) -40°C …+105°C (*) -40°C …+125°C (*) -40°C …+105°C (*) -40°C …+105°C (*) -40°C …+105°C (*) -40°C …+85°C (*) -40°C …+85°C 8, 8…16 8, 8…16 10, 8…16 12, 7…20 16, 10…20 16, 10…20 16, 10…20 16, 12…20 16, 12…20 16, 12…20 16, 12…30 16, 12…30 - yes yes yes - - - - - - - - KX-4.pdf <http://www.geyer-electronic.de/uploads/tx_userartikelfrequenz/GEYER-KX-4.pdf> KX-5.pdf <http://www.geyer-electronic.de/uploads/tx_userartikelfrequenz/GEYER-KX-5.pdf> KX-6.pdf <http://www.geyer-electronic.de/uploads/tx_userartikelfrequenz/GEYER-KX-6.pdf> KX-7.pdf <http://www.geyer-electronic.de/uploads/tx_userartikelfrequenz/GEYER-KX-7.pdf> KX-9A.pdf <http://www.geyer-electronic.de/uploads/tx_userartikelfrequenz/GEYER-KX-9A.pdf> KX-9B.pdf <http://www.geyer-electronic.de/uploads/tx_userartikelfrequenz/GEYER-KX-9B.pdf> KX-12A.pdf <http://www.geyer-electronic.de/uploads/tx_userartikelfrequenz/GEYER-KX-12A.pdf> KX-12B.pdf <http://www.geyer-electronic.de/uploads/tx_userartikelfrequenz/GEYER-KX-12B.pdf> KX-13.pdf <http://www.geyer-electronic.de/uploads/tx_userartikelfrequenz/GEYER-KX-13.pdf> KX-20.pdf <http://www.geyer-electronic.de/uploads/tx_userartikelfrequenz/GEYER-KX-20.pdf> KX-K.pdf <http://www.geyer-electronic.de/uploads/tx_userartikelfrequenz/GEYER-KX-K.pdf> KX-KS.pdf <http://www.geyer-electronic.de/uploads/tx_userartikelfrequenz/GEYER-KX-KS.pdf> <http://www.geyer-electronic.de/fileadmin/template/img/logo-geyer-electronic.png> Details see: http://www.geyer-electronic.de/Frequenz-Produkte.9.0.html Created 2016-06-07, Hans Locher 2016 (C) Geyer Quartz Technology KX4,KX5,KX6,KX7,KX9A,KX9B,KX12A,KX12B,KX13,KX20,KXK,KXKS;1612;2016;2520;3225;5032;6035;7050;11655;12345;1,6x1,2;2,0x1,6;2,5x2,0;3,2x2,5;5,0x3,2;6,0x3,5;7,0x5,0;11,6x5,5;12,3x4,5;12,3x4,5;1.6x1.2;2.0x1.6;2.5x2.0;3.2x2.5;5.0x3.2;6.0x3.5;7.0x5.0;11.6x5.5;12.3x4.5;12.3x4.5;
R2-R10 R13 R15 R19 R22 R23 R26-R29 = rcl:R-EU_: RESISTOR, European symbol; SPICEPREFIX: R
R11 R17 R18 R20 R21 = rcl:R-EU_: RESISTOR, European symbol
S1 = switch-omron:31-XX: OMRON SWITCH; MPN: B3F-3100; OC_FARNELL: 959704; OC_NEWARK: 36M3582
U1 = SparkFun-IC-Microcontroller:ATMEGA2560: Atmel 100-pin 8-bit uC 64/128/256 Kbytes FLASH 4 Kbytes EEPROM 8 Kbytes SRAM 86 General Purpose I/O pins 12-channels16-bit PWM 4 x Serial USARTs 16-channels 10-bit A/D SparkFun Products None.; PROD_ID: IC-10040
U2 = AS6C4008-55SIN:AS6C4008-55SIN: CMOS SRAM Check availability <https://pricing.snapeda.com/parts/AS6C4008-55SIN/Alliance/view-part?ref=eda>